# Altium schematic sheet hdmi.SchDoc
size 420 x 297 mm
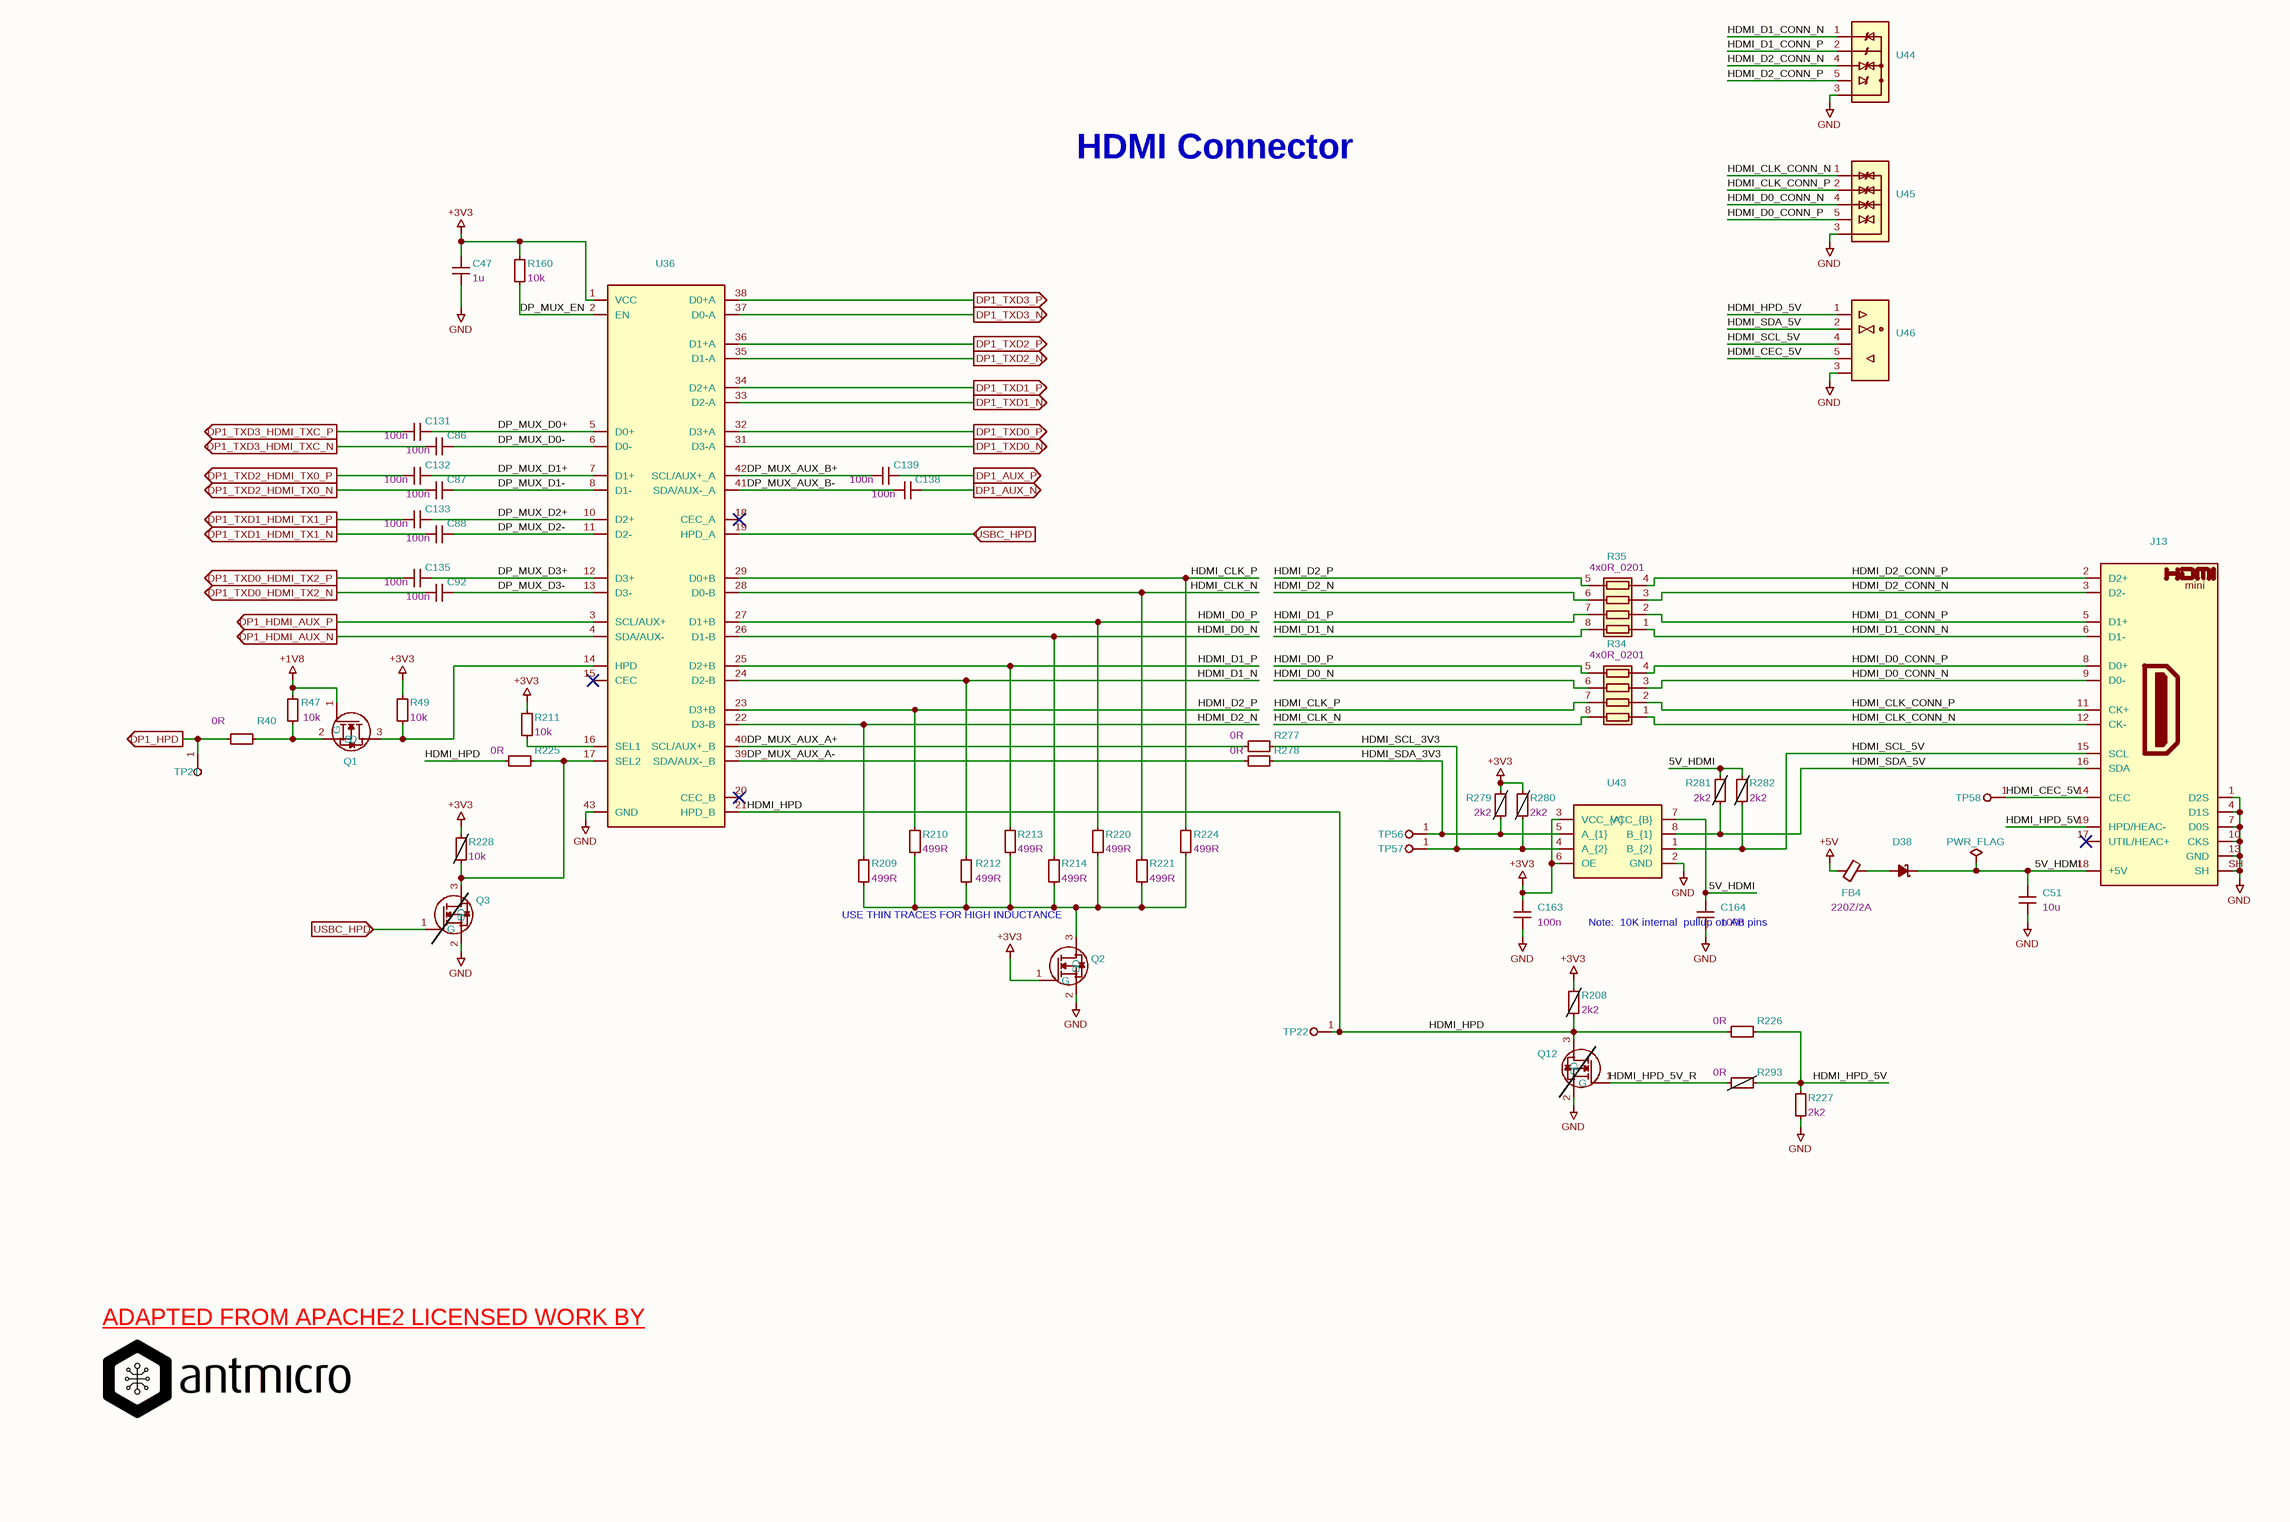
[diagram p0: hdmi.SchDoc]

## Parts
#FLG08  PWR_FLAG  (graphical)
C47  Val: 1u  [C_0402_1005Metric]  (hidden comment: C1005X6S1A105K050BC)
C51  Val: 10u  [C_0603_1608Metric]  (hidden comment: GRM188R61A106KE69D)
C86  Val: 100n  [C_0402_1005Metric]  (hidden comment: GRM155R61H104KE14D)
C87  Val: 100n  [C_0402_1005Metric]  (hidden comment: GRM155R61H104KE14D)
C88  Val: 100n  [C_0402_1005Metric]  (hidden comment: GRM155R61H104KE14D)
C92  Val: 100n  [C_0402_1005Metric]  (hidden comment: GRM155R61H104KE14D)
C131  Val: 100n  [C_0402_1005Metric]  (hidden comment: GRM155R61H104KE14D)
C132  Val: 100n  [C_0402_1005Metric]  (hidden comment: GRM155R61H104KE14D)
C133  Val: 100n  [C_0402_1005Metric]  (hidden comment: GRM155R61H104KE14D)
C135  Val: 100n  [C_0402_1005Metric]  (hidden comment: GRM155R61H104KE14D)
C138  Val: 100n  [C_0402_1005Metric]  (hidden comment: GRM155R61H104KE14D)
C139  Val: 100n  [C_0402_1005Metric]  (hidden comment: GRM155R61H104KE14D)
C163  Val: 100n  [C_0402_1005Metric]  (hidden comment: GRM155R61H104KE14D)
C164  Val: 100n  [C_0402_1005Metric]  (hidden comment: GRM155R61H104KE14D)
D38  RB521S30T1G  [SOD-523]  (value not drawn)
FB4  Val: 220Z/2A  [FB_0805_2012Metric]  (hidden comment: BLM21PG221SN1D)
J13  685119136923  [HDMI-Mini-C_Receptacle_WE_685119136923]  (value not drawn)
Q1  PJE138K_R1_00001  [SOT-523]  (value not drawn)
Q2  PJE138K_R1_00001  [SOT-523]  (value not drawn)
Q3  PJE138K_R1_00001  [SOT-523]  (value not drawn)  (no BOM)
Q12  PJE138K_R1_00001  [SOT-523]  (value not drawn)  (no BOM)
R34  Val: 4x0R_0201  [R_Array_4x0201_Panasonic_EXB18V]  (hidden comment: EXB-18VR000X)
R35  Val: 4x0R_0201  [R_Array_4x0201_Panasonic_EXB18V]  (hidden comment: EXB-18VR000X)
R40  Val: 0R  [R_0402_1005Metric]  (hidden comment: ERJ2GE0R00X)
R47  Val: 10k  [R_0402_1005Metric]  (hidden comment: CR0402-FX-1002GLF)
R49  Val: 10k  [R_0402_1005Metric]  (hidden comment: CR0402-FX-1002GLF)
R160  Val: 10k  [R_0402_1005Metric]  (hidden comment: CR0402-FX-1002GLF)
R208  Val: 2k2  [R_0402_1005Metric]  (hidden comment: CR0402-FX-2201GLF)  (no BOM)
R209  Val: 499R  [R_0402_1005Metric]  (hidden comment: CR0402-FX-4990GLF)
R210  Val: 499R  [R_0402_1005Metric]  (hidden comment: CR0402-FX-4990GLF)
R211  Val: 10k  [R_0402_1005Metric]  (hidden comment: CR0402-FX-1002GLF)
R212  Val: 499R  [R_0402_1005Metric]  (hidden comment: CR0402-FX-4990GLF)
R213  Val: 499R  [R_0402_1005Metric]  (hidden comment: CR0402-FX-4990GLF)
R214  Val: 499R  [R_0402_1005Metric]  (hidden comment: CR0402-FX-4990GLF)
R220  Val: 499R  [R_0402_1005Metric]  (hidden comment: CR0402-FX-4990GLF)
R221  Val: 499R  [R_0402_1005Metric]  (hidden comment: CR0402-FX-4990GLF)
R224  Val: 499R  [R_0402_1005Metric]  (hidden comment: CR0402-FX-4990GLF)
R225  Val: 0R  [R_0402_1005Metric]  (hidden comment: ERJ2GE0R00X)
R226  Val: 0R  [R_0402_1005Metric]  (hidden comment: ERJ2GE0R00X)
R227  Val: 2k2  [R_0402_1005Metric]  (hidden comment: CR0402-FX-2201GLF)
R228  Val: 10k  [R_0402_1005Metric]  (hidden comment: CR0402-FX-1002GLF)  (no BOM)
R277  Val: 0R  [R_0402_1005Metric]  (hidden comment: ERJ2GE0R00X)
R278  Val: 0R  [R_0402_1005Metric]  (hidden comment: ERJ2GE0R00X)
R279  Val: 2k2  [R_0402_1005Metric]  (hidden comment: CR0402-FX-2201GLF)  (no BOM)
R280  Val: 2k2  [R_0402_1005Metric]  (hidden comment: CR0402-FX-2201GLF)  (no BOM)
R281  Val: 2k2  [R_0402_1005Metric]  (hidden comment: CR0402-FX-2201GLF)  (no BOM)
R282  Val: 2k2  [R_0402_1005Metric]  (hidden comment: CR0402-FX-2201GLF)  (no BOM)
R293  Val: 0R  [R_0402_1005Metric]  (hidden comment: ERJ2GE0R00X)  (no BOM)
TP21  TP_0.75mm_SMD  [TP_SMD_0.75mm]  (value not drawn)  (no BOM)
TP22  TP_0.75mm_SMD  [TP_SMD_0.75mm]  (value not drawn)  (no BOM)
TP56  TP_0.75mm_SMD  [TP_SMD_0.75mm]  (value not drawn)  (no BOM)
TP57  TP_0.75mm_SMD  [TP_SMD_0.75mm]  (value not drawn)  (no BOM)
TP58  TP_0.75mm_SMD  [TP_SMD_0.75mm]  (value not drawn)  (no BOM)
U36  TS3DV642RUARQ1  [WQFN-42-1EP_3.5x9mm_P0.5mm]  (value not drawn)
U43  NTS0102GT  [XSON-8_1x1.95mm_P0.5mm]  (value not drawn)
U44  TPD4E05U06QDQARQ1  [USON-10_2.5x1mm_P0.5mm]  (value not drawn)
U45  TPD4E05U06QDQARQ1  [USON-10_2.5x1mm_P0.5mm]  (value not drawn)
U46  TPD4E05U06QDQARQ1  [USON-10_2.5x1mm_P0.5mm]  (value not drawn)

## Ports
DP1_AUX_N (out), DP1_AUX_P (out), DP1_HDMI_AUX_N (out), DP1_HDMI_AUX_P (out), DP1_HPD (out), DP1_TXD0_HDMI_TX2_N (out), DP1_TXD0_HDMI_TX2_P (out), DP1_TXD0_N (out), DP1_TXD0_P (out), DP1_TXD1_HDMI_TX1_N (out), DP1_TXD1_HDMI_TX1_P (out), DP1_TXD1_N (out), DP1_TXD1_P (out), DP1_TXD2_HDMI_TX0_N (out), DP1_TXD2_HDMI_TX0_P (out), DP1_TXD2_N (out), DP1_TXD2_P (out), DP1_TXD3_HDMI_TXC_N (out), DP1_TXD3_HDMI_TXC_P (out), DP1_TXD3_N (out), DP1_TXD3_P (out), USBC_HPD (in)

## Nets
+1V8: Q1.1(G) R47.2
+3V3: C47.2 C163.2 Q2.1(G) R49.2 R160.2 R208.2 R211.2 R228.2 R279.2 R280.2 U36.1(VCC) U43.3(VCC_{A}) U43.6(OE)
+5V: FB4.1
GND: C47.1 C51.2 C163.1 C164.1 J13.1(D2S) J13.4(D1S) J13.7(D0S) J13.10(CKS) J13.13(GND) J13.SH Q2.2(S) Q3.2(S) Q12.2(S) R227.1 U36.43(GND) U43.2(GND) U44.3 U45.3 U46.3
5V_HDMI: #FLG08.1(pwr) C51.1 C164.2 D38.1(C) J13.18(+5V) R281.2 R282.2 U43.7(VCC_{B})
DP1_AUX_N: C138.1 ; port DP1_AUX_N
DP1_AUX_P: C139.1 ; port DP1_AUX_P
DP1_HDMI_AUX_N: U36.4(SDA/AUX-) ; port DP1_HDMI_AUX_N
DP1_HDMI_AUX_P: U36.3(SCL/AUX+) ; port DP1_HDMI_AUX_P
DP1_HPD: R40.2 TP21.1 ; port DP1_HPD
DP1_TXD0_HDMI_TX2_N: C92.2 ; port DP1_TXD0_HDMI_TX2_N
DP1_TXD0_HDMI_TX2_P: C135.2 ; port DP1_TXD0_HDMI_TX2_P
DP1_TXD0_N: U36.31(D3-A) ; port DP1_TXD0_N
DP1_TXD0_P: U36.32(D3+A) ; port DP1_TXD0_P
DP1_TXD1_HDMI_TX1_N: C88.2 ; port DP1_TXD1_HDMI_TX1_N
DP1_TXD1_HDMI_TX1_P: C133.2 ; port DP1_TXD1_HDMI_TX1_P
DP1_TXD1_N: U36.33(D2-A) ; port DP1_TXD1_N
DP1_TXD1_P: U36.34(D2+A) ; port DP1_TXD1_P
DP1_TXD2_HDMI_TX0_N: C87.2 ; port DP1_TXD2_HDMI_TX0_N
DP1_TXD2_HDMI_TX0_P: C132.2 ; port DP1_TXD2_HDMI_TX0_P
DP1_TXD2_N: U36.35(D1-A) ; port DP1_TXD2_N
DP1_TXD2_P: U36.36(D1+A) ; port DP1_TXD2_P
DP1_TXD3_HDMI_TXC_N: C86.2 ; port DP1_TXD3_HDMI_TXC_N
DP1_TXD3_HDMI_TXC_P: C131.2 ; port DP1_TXD3_HDMI_TXC_P
DP1_TXD3_N: U36.37(D0-A) ; port DP1_TXD3_N
DP1_TXD3_P: U36.38(D0+A) ; port DP1_TXD3_P
DP_MUX_AUX_A+: R277.1 U36.40(SCL/AUX+_B)
DP_MUX_AUX_A-: R278.1 U36.39(SDA/AUX-_B)
DP_MUX_AUX_B+: C139.2 U36.42(SCL/AUX+_A)
DP_MUX_AUX_B-: C138.2 U36.41(SDA/AUX-_A)
DP_MUX_D0+: C131.1 U36.5(D0+)
DP_MUX_D0-: C86.1 U36.6(D0-)
DP_MUX_D1+: C132.1 U36.7(D1+)
DP_MUX_D1-: C87.1 U36.8(D1-)
DP_MUX_D2+: C133.1 U36.10(D2+)
DP_MUX_D2-: C88.1 U36.11(D2-)
DP_MUX_D3+: C135.1 U36.12(D3+)
DP_MUX_D3-: C92.1 U36.13(D3-)
DP_MUX_EN: R160.1 U36.2(EN)
HDMI_CEC_5V: J13.14(CEC) TP58.1 U46.5
HDMI_CLK_CONN_N: J13.12(CK-) R34.1(R1.1) U45.1
HDMI_CLK_CONN_P: J13.11(CK+) R34.2(R2.1) U45.2
HDMI_CLK_N: R34.8(R1.2) R221.2 U36.28(D0-B)
HDMI_CLK_P: R34.7(R2.2) R224.2 U36.29(D0+B)
HDMI_D0_CONN_N: J13.9(D0-) R34.3(R3.1) U45.4
HDMI_D0_CONN_P: J13.8(D0+) R34.4(R4.1) U45.5
HDMI_D0_N: R34.6(R3.2) R214.2 U36.26(D1-B)
HDMI_D0_P: R34.5(R4.2) R220.2 U36.27(D1+B)
HDMI_D1_CONN_N: J13.6(D1-) R35.1(R1.1) U44.1
HDMI_D1_CONN_P: J13.5(D1+) R35.2(R2.1) U44.2
HDMI_D1_N: R35.8(R1.2) R212.2 U36.24(D2-B)
HDMI_D1_P: R35.7(R2.2) R213.2 U36.25(D2+B)
HDMI_D2_CONN_N: J13.3(D2-) R35.3(R3.1) U44.4
HDMI_D2_CONN_P: J13.2(D2+) R35.4(R4.1) U44.5
HDMI_D2_N: R35.6(R3.2) R209.2 U36.22(D3-B)
HDMI_D2_P: R35.5(R4.2) R210.2 U36.23(D3+B)
HDMI_HPD: Q12.3(D) R208.1 R225.1 R226.1 TP22.1 U36.21(HPD_B)
HDMI_HPD_5V: J13.19(HPD/HEAC-) R226.2 R227.2 R293.2 U46.1
HDMI_HPD_5V_R: Q12.1(G) R293.1
HDMI_SCL_3V3: R277.2 R280.1 TP57.1 U43.4(A_{2})
HDMI_SCL_5V: J13.15(SCL) R282.1 U43.1(B_{2}) U46.4
HDMI_SDA_3V3: R278.2 R279.1 TP56.1 U43.5(A_{1})
HDMI_SDA_5V: J13.16(SDA) R281.1 U43.8(B_{1}) U46.2
USBC_HPD: Q3.1(G) U36.19(HPD_A) ; port USBC_HPD
NetD38_2: D38.2(A) FB4.2
NetQ1_2: Q1.2(S) R40.1 R47.1
NetQ1_3: Q1.3(D) R49.1 U36.14(HPD)
NetQ2_3: Q2.3(D) R209.1 R210.1 R212.1 R213.1 R214.1 R220.1 R221.1 R224.1
NetQ3_3: Q3.3(D) R225.2 R228.1 U36.17(SEL2)
NetR211_1: R211.1 U36.16(SEL1)

Not connected (* = marked no-connect by the designer): J13 17(UTIL/HEAC+)*; U36 9(NC) 15(CEC)* 18(CEC_A)* 20(CEC_B)* 30(NC); U44 6 7 8 9 10; U45 6 7 8 9 10; U46 6 7 8 9 10

## Notes on the sheet
- HDMI Connector
- USE THIN TRACES FOR HIGH INDUCTANCE
- (near C164) Note:
  10K internal
  pullup
  on AB pins
- ADAPTED FROM APACHE2 LICENSED WORK BY <https://github.com/antmicro/jetson-orin-baseboard>
- 1
- 2
- 3
- 4
- 5
- 6
- 7
- 8
- A
- B
- C
- D
- E
- www.antmicro.com <http://www.antmicro.com>
- Title: Jetson Orin Baseboard
- File: hdmi.kicad_sch
- Sheet: /
- Antmicro Ltd
- F
- KiCad E.D.A.  kicad (5.1.4)-1
- Size: A3
- Date: 2025-01-15
- Rev: 1.3.0
- Id: 1/1
- (in symbol HDMI-Mini-C_WE_685119136923) mini

## Library data of the parts
C47 = C_1u_0402: Manufacturer 1: TDK; License: Apache-2.0; Author: Antmicro; OldValue: C_1u_0402; Manufacturer Part Number 1: C1005X6S1A105K050BC; Value: C1005X6S1A105K050BC; Footprint: antmicro-footprints:C_0402_1005Metric
C51 = C_10u_0603: Manufacturer 1: Murata; License: Apache-2.0; Dielectric: template_dielectric; Author: Antmicro; OldValue: C_10u_0603; Manufacturer Part Number 1: GRM188R61A106KE69D; Value: GRM188R61A106KE69D; Footprint: antmicro-footprints:C_0603_1608Metric
C86-C88 C92 C131-C133 C135 C138 C139 C163 C164 = C_100n_0402: Manufacturer 1: Murata; License: Apache-2.0; Voltage: 50V; Dielectric: X5R; Author: Antmicro; OldValue: C_100n_0402; Manufacturer Part Number 1: GRM155R61H104KE14D; Value: GRM155R61H104KE14D; Footprint: antmicro-footprints:C_0402_1005Metric
D38 = RB521S30T1G: Manufacturer 1: ON Semiconductor; License: Apache-2.0; Author: Antmicro; OldValue: RB521S30T1G; Manufacturer Part Number 1: RB521S30T1G; Value: RB521S30T1G; Footprint: antmicro-footprints:SOD-523
FB4 = FB_220Z_2A_Murata-BLM21PG_0805: Manufacturer 1: Murata; License: Apache-2.0; Author: Antmicro; OldValue: FB_220Z_2A_Murata-BLM21PG_0805; Manufacturer Part Number 1: BLM21PG221SN1D; Value: BLM21PG221SN1D; Footprint: antmicro-footprints:FB_0805_2012Metric
J13 = HDMI-Mini-C_WE_685119136923: Manufacturer 1: Würth Elektronik; License: Apache-2.0; Author: Antmicro; OldValue: HDMI-Mini-C_WE_685119136923; Manufacturer Part Number 1: 685119136923; Value: 685119136923; Footprint: antmicro-footprints:HDMI-Mini-C_Receptacle_WE_685119136923
Q1-Q3 Q12 = PJE138K: Manufacturer 1: PANJIT; License: Apache-2.0; Author: Antmicro; OldValue: PJE138K; Manufacturer Part Number 1: PJE138K_R1_00001; Value: PJE138K_R1_00001; Footprint: antmicro-footprints:SOT-523
R34 R35 = R_4x0R_0201_array: Manufacturer 1: Panasonic; License: Apache-2.0; Author: Antmicro; OldValue: R_4x0R_0201_array; Manufacturer Part Number 1: EXB-18VR000X; Value: EXB-18VR000X; Footprint: antmicro-footprints:R_Array_4x0201_Panasonic_EXB18V
R40 R225 R226 R277 R278 R293 = R_0R_0402: Manufacturer 1: Panasonic; License: Apache-2.0; Tolerance: ~; Current: 1A; Author: Antmicro; OldValue: R_0R_0402; Manufacturer Part Number 1: ERJ2GE0R00X; Value: ERJ2GE0R00X; Footprint: antmicro-footprints:R_0402_1005Metric
R47 R49 R160 R211 R228 = R_10k_0402: Manufacturer 1: Bourns; License: Apache-2.0; Tolerance: 1%; Author: Antmicro; OldValue: R_10k_0402; Manufacturer Part Number 1: CR0402-FX-1002GLF; Value: CR0402-FX-1002GLF; Footprint: antmicro-footprints:R_0402_1005Metric
R208 R227 R279-R282 = R_2k2_0402: Manufacturer 1: Bourns; License: Apache-2.0; Tolerance: 1%; Author: Antmicro; OldValue: R_2k2_0402; Manufacturer Part Number 1: CR0402-FX-2201GLF; Value: CR0402-FX-2201GLF; Footprint: antmicro-footprints:R_0402_1005Metric
R209 R210 R212-R214 R220 R221 R224 = R_499R_0402: Manufacturer 1: Bourns; License: Apache-2.0; Tolerance: 1%; Author: Antmicro; OldValue: R_499R_0402; Manufacturer Part Number 1: CR0402-FX-4990GLF; Value: CR0402-FX-4990GLF; Footprint: antmicro-footprints:R_0402_1005Metric
TP21 TP22 TP56-TP58 = TP_0.75mm_SMD: License: Apache-2.0; Author: Antmicro; OldValue: TP_0.75mm_SMD; Value: TP_0.75mm_SMD; Footprint: antmicro-footprints:TP_SMD_0.75mm
U36 = TS3DV642RUARQ1: Manufacturer 1: Texas Instruments; License: Apache-2.0; Author: Antmicro; OldValue: TS3DV642RUARQ1; Manufacturer Part Number 1: TS3DV642RUARQ1; Value: TS3DV642RUARQ1; Footprint: antmicro-footprints:WQFN-42-1EP_3.5x9mm_P0.5mm
U43 = NTS0102_XSON: Manufacturer 1: NXP; License: Apache-2.0; Author: Antmicro; OldValue: NTS0102_XSON; Manufacturer Part Number 1: NTS0102GT; Value: NTS0102GT; Footprint: antmicro-footprints:XSON-8_1x1.95mm_P0.5mm
U44-U46 = TPD4E05U06QDQARQ1: Manufacturer 1: Texas Instruments; License: Apache-2.0; Author: Antmicro; OldValue: TPD4E05U06QDQARQ1; Manufacturer Part Number 1: TPD4E05U06QDQARQ1; Value: TPD4E05U06QDQARQ1; Footprint: antmicro-footprints:USON-10_2.5x1mm_P0.5mm
#FLG08 = PWR_FLAG: Value: PWR_FLAG